# Altium schematic sheet CW340_USERIO_USB.SchDoc: User USB Connection
size Letter; Organization: NewAE Technology Inc.; Address1: 1083 Queen St., Suite 196; Address2: Halifax; Address3: NS; Address4: Canada B3H 0B2; DocumentNumber: .; Revision: .; SheetNumber: 27; SheetTotal: 31; SheetApproved: Yes
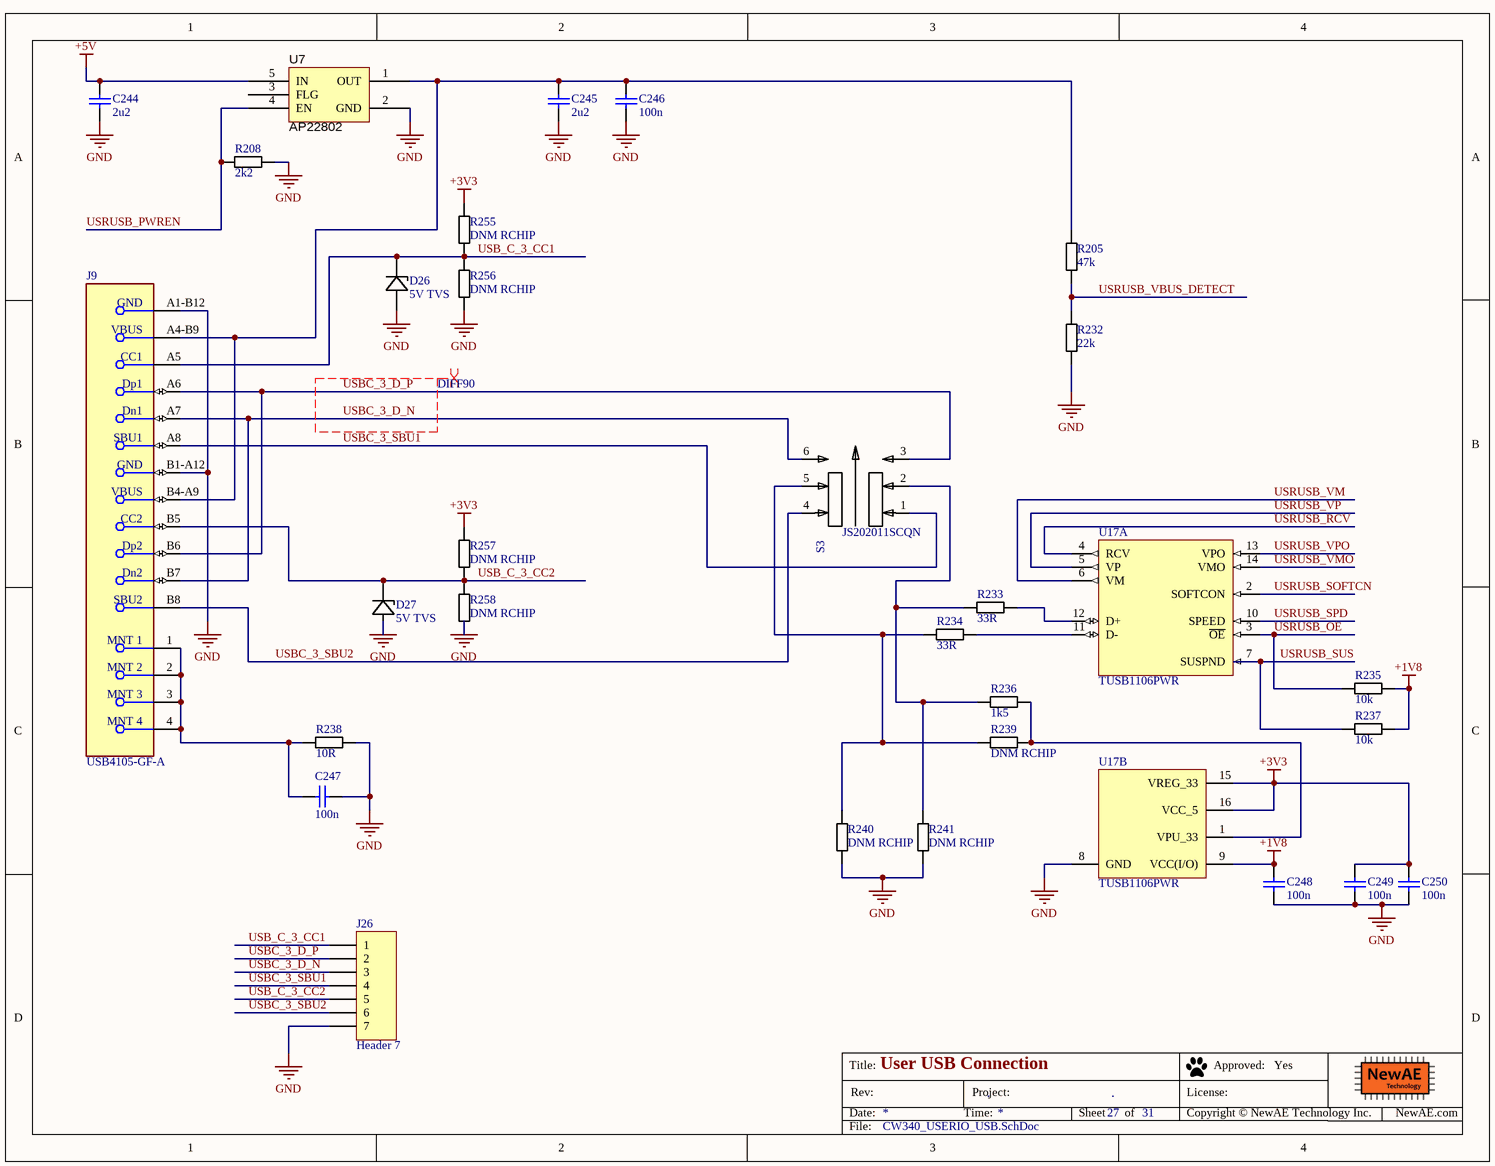
[diagram p0: CW340_USERIO_USB.SchDoc]

## Parts
C244  2u2  [CAPC0603_M]
C245  2u2  [CAPC0603_M]
C246  100n  [CAPC0402_M]
C247  100n  [CAPC0603_M]
C248  100n  [CAPC0402_M]
C249  100n  [CAPC0402_M]
C250  100n  [CAPC0402_M]
D26  5V TVS  [SOD-523]
D27  5V TVS  [SOD-523]
J9  USB4105-GF-A  [FP-USB4105-GF-A-MFG]
J26  Header 7  [HDR1X7]
R205  47k  [RESC1608X55N]
R208  2k2  [RESC1005X40N]
R232  22k  [RESC1608X55N]
R233  33R  [RESC1608X55N]
R234  33R  [RESC1608X55N]
R235  10k  [RESC1005X40N]
R236  1k5  [RESC1608X55N]
R237  10k  [RESC1005X40N]
R238  10R  [RESC1608X55N]
R239  DNM RCHIP  [RESC1608X55N]
R240  DNM RCHIP  [RESC1608X55N]
R241  DNM RCHIP  [RESC1608X55N]
R255  DNM RCHIP  [RESC1608X55N]
R256  DNM RCHIP  [RESC1608X55N]
R257  DNM RCHIP  [RESC1608X55N]
R258  DNM RCHIP  [RESC1608X55N]
S3  JS202011SCQN  [SW_JS202011SCQN]
U7  AP22802  [SOT23-5P95_285X145L45X40]
U17  TUSB1106PWR  [PW0016A_L]  (parts A,B of 2)

## Nets
+1V8: C248.1 R235.2 R237.2 U17.9(VCC(I/O))
+3V3: C249.1 C250.1 R255.1 R257.1 U17.15(VREG_33) U17.16(VCC_5)
+5V: C244.1 U7.5(IN)
GND: C244.2 C245.2 C246.2 C247.2 C248.2 C249.2 C250.2 D26.2(A) D27.2(A) J9.A1-B12(GND) J9.B1-A12(GND) J26.7 R208.2 R232.2 R238.2 R240.1 R241.1 R256.2 R258.2 U7.2(GND) U17.8(GND)
USB_C_3_CC1: D26.1(K) J9.A5(CC1) J26.1 R255.2 R256.1
USB_C_3_CC2: D27.1(K) J9.B5(CC2) J26.5 R257.2 R258.1
USBC_3_D_N: J9.A7(Dn1) J9.B7(Dn2) J26.3 S3.6
USBC_3_D_P: J9.A6(Dp1) J9.B6(Dp2) J26.2 S3.3
USBC_3_SBU1: J9.A8(SBU1) J26.4 S3.1
USBC_3_SBU2: J9.B8(SBU2) J26.6 S3.4
USRUSB_OE: R235.1 U17.3(~{OE})
USRUSB_PWREN: R208.1 U7.4(EN)
USRUSB_RCV: U17.4(RCV)
USRUSB_SOFTCN: U17.2(SOFTCON)
USRUSB_SPD: U17.10(SPEED)
USRUSB_SUS: R237.1 U17.7(SUSPND)
USRUSB_VBUS_DETECT: R205.2 R232.1
USRUSB_VM: U17.6(VM)
USRUSB_VMO: U17.14(VMO)
USRUSB_VP: U17.5(VP)
USRUSB_VPO: U17.13(VPO)
NetC245_1: C245.1 C246.1 J9.A4-B9(VBUS) J9.B4-A9(VBUS) R205.1 U7.1(OUT)
NetC247_1: C247.1 J9.1(MNT_1) J9.2(MNT_2) J9.3(MNT_3) J9.4(MNT_4) R238.1
NetR233_1: R233.1 R236.1 R241.2 S3.2
NetR233_2: R233.2 U17.12(D+)
NetR234_1: R234.1 R239.1 R240.2 S3.5
NetR234_2: R234.2 U17.11(D-)
NetR236_2: R236.2 R239.2 U17.1(VPU_33)

Not connected (* = marked no-connect by the designer): U7 3(FLG)

## Layout directives
differential pair; differential pair class DIFF90: USBC_3_D_N, USBC_3_D_P

## Notes on the sheet
- Title:
- Date:
- Rev:
- Time:
- Project:
- Sheet
- of
- License:
- Copyright © NewAE Technology Inc.
- Approved:
- NewAE.com
- File:

## Library data of the parts
C244 C245 = CCHIP-2u2-0603: 2u2, 0603; Manufacture 1: Samsung; Manufacture Part Number 1: CL10B225KP8NNNC; Component Group: Capacitor; Case-EIA: 0603; Case-Metric: 1608; Rated Voltage: 10VDC; Part Number: CCHIP-2u2-0603; Footprint: 0603; Pin Count: 2; Supplier 1: Digi-Key; Supplier Part Number 1: 1276-1134-1-ND; Value: 2u2; Mounting Technology: SMT; Component Kind: Standard; Component Type: Standard
C246 C248-C250 = CCHIP-100n-0402: 100n, 0402; Manufacture Part Number 1: CGA2B3X7R1V104K050BB; Component Group: Capacitor; Case-EIA: 0402; Part Number: CCHIP-100n-0402; Footprint: 0402; Pin Count: 2; Value: 100n; Mounting Technology: SMT; Component Kind: Standard; Component Type: Standard; Supplier 1: Digi-Key; Supplier Part Number 1: 445-6901-1-ND
C247 = CCHIP-100n-0603: 100n, 0603; Manufacture 1: Kemet; Manufacture Part Number 1: C0603C104K5RACTU; Component Group: Capacitor; Case-EIA: 0603; Case-Metric: 1608; Rated Voltage: 50VDC; Part Number: CCHIP-100n-0603; Footprint: 0603; Pin Count: 2; Supplier 1: Digi-Key; Supplier Part Number 1: 399-5089-2-ND; Value: 100n; Mounting Technology: SMT; Component Kind: Standard; Component Type: Standard
D26 D27 = VESD05B1-02V-G3-08: TVS DIODE 1VSO 5VBD SOD523; Manufacture 1: Vishay; PP Material Stack: 0; Part Number: VESD05B1-02V-G3-08; Component Group: Diode; Manufacture Part Number 1: VESD05B1-02V-G3-08; Pin Count: 2; Supplier 1: Digi-Key; Supplier Part Number 1: VESD05B1-02V-G3-08GICT-ND; Mounting Technology: SMT; RoHS: Yes; Component Kind: Standard; Component Type: Standard; PP Rotation: 0
J9 = CMP-245163-000001-1: CONN RCPT USB2.0 TYPEC 5A; Manufacturer: GCT; Voltage Rating: 20V; Is Female: yes; Current Rating: 5/6.25/1.25/0.25A; Number Of Contacts: 16; Conn Orientation: Right Angle; Device Class L1: Connectors; Category: Conn; Lead Free: Yes; RoHS: TRUE; Temperature Range High: +85°C; Digikey Description: CONN RCPT USB2.0 TYPEC 5A; Device Class L3: unset; ComponentLink2Description: Datasheet; Manufacturer Part Number: USB4105-GF-A; Package: 0; Usb Standard: USB 2.0; Device Class L2: USB Connectors; Automotive: No; Temperature Range Low: -40°C; Height: 3.46mm; Temperature: -40°C to +85°C; Contact Material: Gold,Nickel; ComponentLink2URL: https://gct.co/files/drawings/usb4105.pdf; Octopart: https://octopart.com/usb4105-gf-a-gct-106627878
J26 = Header 7: Header, 7-Pin; LatestRevisionDate: 17-Jul-2002; LatestRevisionNote: Re-released for DXP Platform.; Publisher: Altium Limited
R205 = RCHIP-47K-0603: 47k res, 0603, 1%, 1/10W; Manufacture 1: Yageo; Manufacture Part Number 1: RC0603FR-0747KL; Component Group: Resistor; Case-EIA: 0603; Case-Metric: 1608; Rated Power: 0.1W; Rated Voltage: 75VDC; Part Number: RCHIP-47K-0603; Footprint: 0603; Pin Count: 2; Supplier 1: Digi-Key; Supplier Part Number 1: 311-47.0KHRCT-ND; Value: 47k; Tolerance: 1%; Mounting Technology: SMT; Temperature Range: -55C to 155C; Component Kind: Standard; Component Type: Standard
R208 = RCHIP-2K2-0402: 2k2 res, 0402, 1%, 1/16W; Manufacture 1: Yageo; Manufacture Part Number 1: RC0402FR-072K2L; Component Group: Resistor; Case-EIA: 0402; Case-Metric: 1005; Rated Power: 0.063W; Rated Voltage: 75VDC; Part Number: RCHIP-2K2-0402; Footprint: 0402; Pin Count: 2; Supplier 1: Digi-Key; Supplier Part Number 1: 311-2.20KLRCT-ND; Value: 2k2; Tolerance: 1%; Mounting Technology: SMT; Temperature Range: -55C to 155C; Component Kind: Standard; Component Type: Standard
R232 = RCHIP-22K-0603: 22k res, 0603, 1%, 1/10W; Manufacture 1: Yageo; Manufacture Part Number 1: RC0603FR-0722KL; Component Group: Resistor; Case-EIA: 0603; Case-Metric: 1608; Rated Power: 0.1W; Rated Voltage: 75VDC; Part Number: RCHIP-22K-0603; Footprint: 0603; Pin Count: 2; Supplier 1: Digi-Key; Supplier Part Number 1: 311-22.0KHRCT-ND; Value: 22k; Tolerance: 1%; Mounting Technology: SMT; Temperature Range: -55C to 155C; Component Kind: Standard; Component Type: Standard
R233 R234 = RCHIP-33R-0603: 33R res, 0603, 1%, 1/10W; Manufacture 1: Yageo; Manufacture Part Number 1: RC0603FR-0733RL; Component Group: Resistor; Case-EIA: 0603; Case-Metric: 1608; Rated Power: 0.1W; Rated Voltage: 75VDC; Part Number: RCHIP-33R-0603; Footprint: 0603; Pin Count: 2; Supplier 1: Digi-Key; Supplier Part Number 1: 311-33.0HRCT-ND; Value: 33R; Tolerance: 1%; Mounting Technology: SMT; Temperature Range: -55C to 155C; Component Kind: Standard; Component Type: Standard
R235 R237 = RCHIP-10K-0402: 10k res, 0402, 1%, 1/16W; Manufacture 1: Yageo; Manufacture Part Number 1: RC0402FR-0710KL; Component Group: Resistor; Case-EIA: 0402; Case-Metric: 1005; Rated Power: 0.063W; Rated Voltage: 75VDC; Part Number: RCHIP-10K-0402; Footprint: 0402; Pin Count: 2; Supplier 1: Digi-Key; Supplier Part Number 1: 311-10.0KLRCT-ND; Value: 10k; Tolerance: 1%; Mounting Technology: SMT; Temperature Range: -55C to 155C; Component Kind: Standard; Component Type: Standard
R236 = RCHIP-1K5-0603: 1k5 res, 0603, 1%, 1/10W; Manufacture 1: Yageo; Manufacture Part Number 1: RC0603FR-071K5L; Component Group: Resistor; Case-EIA: 0603; Case-Metric: 1608; Rated Power: 0.1W; Rated Voltage: 75VDC; Part Number: RCHIP-1K5-0603; Footprint: 0603; Pin Count: 2; Supplier 1: Digi-Key; Supplier Part Number 1: 311-1.50KHRCT-ND; Value: 1k5; Tolerance: 1%; Mounting Technology: SMT; Temperature Range: -55C to 155C; Component Kind: Standard; Component Type: Standard
R238 = RCHIP-10R-0603: 10R res, 0603, 1%, 1/10W; Manufacture 1: Yageo; Manufacture Part Number 1: RC0603FR-0710RL; Component Group: Resistor; Case-EIA: 0603; Case-Metric: 1608; Rated Power: 0.1W; Rated Voltage: 75VDC; Part Number: RCHIP-10R-0603; Footprint: 0603; Pin Count: 2; Supplier 1: Digi-Key; Supplier Part Number 1: 311-10.0HRCT-ND; Value: 10R; Tolerance: 1%; Mounting Technology: SMT; Temperature Range: -55C to 155C; Component Kind: Standard; Component Type: Standard
R239-R241 R255-R258 = RCHIP-DNM-0603: Do Not Mount Resistor; Case-EIA: 0603; Case-Metric: 1608; Part Number: RCHIP-DNM-0603; Component Group: Resistor; Footprint: 0603; Pin Count: 2; Mounting Technology: SMT; Component Kind: Standard; Component Type: Standard
S3 = JS202011SCQN: DPDT SMD Switch, 300mA; Manufacture 1: C&K Components; Part Number: JS202011SCQN; Component Group: Switch; Manufacture Part Number 1: JS202011SCQN; Pin Count: 6; Supplier 1: Digi-Key; Supplier Part Number 1: 401-2002-1-ND; Value: DPDT; Mounting Technology: SMT; Component Kind: Standard; Component Type: Standard
U7 = AP22802: USB Power Switch, Digital IC; Manufacture 1: Diodes Inc; Company_PN: <Enter Company P/N>; Component Group: Analog IC; PP Material Stack: 0; Created By: D.GODDARD; Part Number: AP22802; Footprint: SOT25; Manufacture Part Number 1: AP22802; Pin Count: 5; Supplier 1: Digi-Key; Supplier Part Number 1: AP22802AW5-7DICT-ND; Component Kind: Standard; Component Type: Standard; PP Rotation: 0
U17 = CMP-0309-00090-2: Advanced USB Transciever, Full Speed, Differential, +/-15 KV, -40 to 85 degC, 16-Pin TSSOP (PW), Green (RoHS & no Sb/Br); Manufacturer: Texas Instruments; SubFamily: USB Transceiver; Eco-Plan: Green (RoHS & no Sb/Br); Mounting Technology: Surface Mount; USB Speed: Full; ComponentLink2URL: http://www.ti.com/lit/ml/mpds361/mpds361.pdf; PackageDescription: 16-Pin Plastic Thin Small Outline Package 5 x 4.4 mm Body ,0.65 mm Pitch; ComponentLink1URL: http://www.ti.com/general/docs/lit/getliterature.tsp?genericPartNumber=TUSB1106&fileType=pdf; DatasheetVersion: SCAS818E; PartNumber: TUSB1106PWR; PackageVersion: revG, Feb-2011; PackageReference: PW0016A; ComponentLink2Description: Package Specification; ESD HBM(kV): +/-15; Code_JEDEC: MO-153; ComponentLink1Description: Datasheet